# Altium project DiffProbe-Powersupply.PrjPcb (part 2 of 2)

## Sheet PositiveRegulator.SchDoc: Positive Regulator
size A4; SheetNumber: 3; SheetTotal: 3
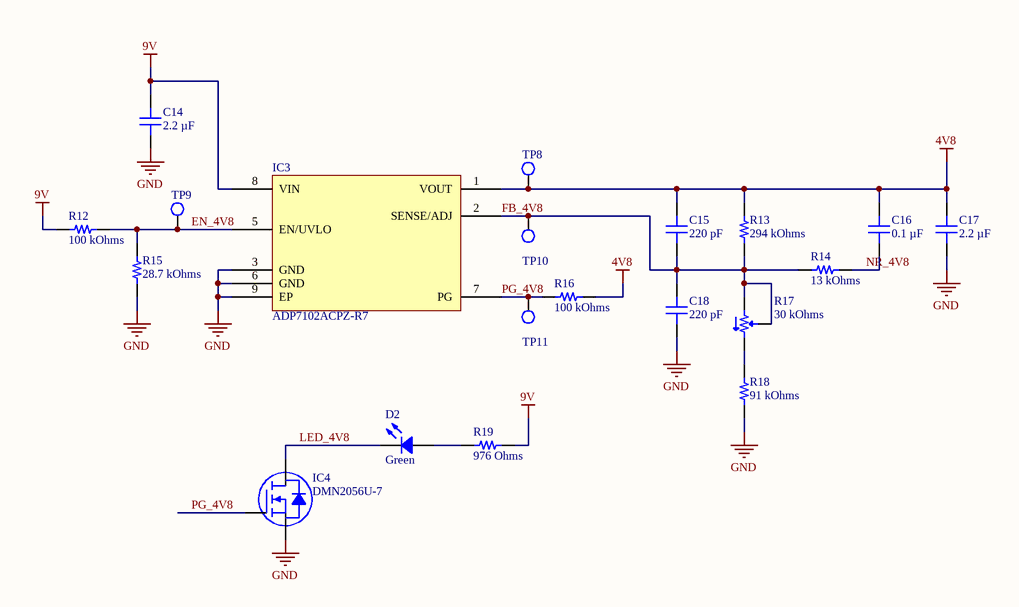
[diagram p2: PositiveRegulator.SchDoc]

### Parts
C14  2.2 µF  [CAP 0805_2012]
C15  220 pF  [CAP 0603_1608]
C16  0.1 µF  [CAP 0603_1608]
C17  2.2 µF  [CAP 0805_2012]
C18  220 pF  [CAP 0603_1608]
D2  Green  [LED 0805_2012 GREEN]
IC3  ADP7102ACPZ-R7  [AD LFCSP-8 3x3MM CP-8-5]
IC4  DMN2056U-7  [DIODES SOT-23-3]
R12  100 kOhms  [RES 0603_1608]
R13  294 kOhms  [RES 0603_1608]
R14  13 kOhms  [RES 0603_1608]
R15  28.7 kOhms  [RES 0603_1608]
R16  100 kOhms  [RES 0603_1608]
R17  30 kOhms  [POT BOURNS TRIMPOT TC33]
R18  91 kOhms  [RES 0603_1608]
R19  976 Ohms  [RES 0805_2012]
TP8  Test Point  [TestPoint-1.5mm]  (value not drawn)  (no BOM)
TP9  Test Point  [TestPoint-1.5mm]  (value not drawn)  (no BOM)
TP10  Test Point  [TestPoint-1.5mm]  (value not drawn)  (no BOM)
TP11  Test Point  [TestPoint-1.5mm]  (value not drawn)  (no BOM)

### Nets
4V8: C15.2 C16.2 C17.2 IC3.1(VOUT) R13.2 R16.2 TP8.1(TP)
9V: C14.2 IC3.8(VIN) R12.2 R19.2
GND: C14.1 C17.1 C18.1 IC3.3(GND) IC3.6(GND) IC3.9(EP) IC4.2(S) R15.1 R18.1
EN_4V8: IC3.5(EN/UVLO) R12.1 R15.2 TP9.1(TP)
FB_4V8: C15.1 C18.2 IC3.2(SENSE/ADJ) R13.1 R14.1 R17.1 R17.2 TP10.1(TP)
LED_4V8: D2.2 IC4.3(D)
NR_4V8: C16.1 R14.2
PG_4V8: IC3.7(PG) IC4.1(G) R16.1 TP11.1(TP)
NetD2_1: D2.1 R19.1
NetR17_3: R17.3 R18.2

### Notes on the sheet
- Title
- Size:
- Date:
- A4
- Number:
- Time:
- Revision:
- Sheet
- of
- File:

### Library data of the parts
C14 C17 = GRM21BR71E225KE11L: CAP CER 2.2UF 25V X7R 0805; manufacturer: Murata Electronics; Tolerance: ±10%; Part Number: GRM21BR71E225KE11L; Value: 2.2 µF; Applications: General Purpose; Capacitance: 2.2 µF; componentlink1description: Datasheet; componentlink1url: https://search.murata.co.jp/Ceramy/image/img/A01X/G101/ENG/GRM21BR71E225KE11-01.pdf; componentlink2description: DigiKey Link; componentlink2url: https://www.digikey.com/en/products/detail/murata-electronics/GRM21BR71E225KE11L/6606096; Device Package: 0805 (2012 Metric); lastupdated: 19/06/2022 07:52:39; Lifecycle Status: Active; Minimum Order: 1; Mounting Type: Surface Mount, MLCC; Operating Temperature: -55°C ~ 125°C; Package / Case: 0805 (2012 Metric); packaging: TapeAndReel; partid: 7355; Part Status: Active; price: 0.03; series: GRM; Size / Dimension: 0.079" L x 0.049" W (2.00mm x 1.25mm); Supplier 1: DigiKey; Supplier Part Number 1: 490-14467-1-ND; Temperature Coefficient: X7R; Thickness (Max): 0.055" (1.40mm); Voltage - Rated: 25V
C15 C18 = CC0603JRNPO8BN221: CAP CER 220PF 25V C0G/NPO 0603; manufacturer: Yageo; Temperature Coefficient: C0G, NP0; Tolerance: ±5%; Part Number: CC0603JRNPO8BN221; Value: 220 pF; Applications: General Purpose; Capacitance: 220 pF; componentlink1description: Datasheet; componentlink1url: https://www.yageo.com/upload/media/product/productsearch/datasheet/mlcc/UPY-GP_NP0_16V-to-50V_17.pdf; componentlink2description: DigiKey Link; componentlink2url: https://www.digikey.com/en/products/detail/yageo/CC0603JRNPO8BN221/5883593; Device Package: 0603 (1608 Metric); lastupdated: 19/06/2022 07:49:09; Lifecycle Status: Active; Minimum Order: 1; Mounting Type: Surface Mount, MLCC; Operating Temperature: -55°C ~ 125°C; Package / Case: 0603 (1608 Metric); packaging: TapeAndReel; partid: 9530; Part Status: Active; price: 0.01; series: CC; Size / Dimension: 0.063" L x 0.031" W (1.60mm x 0.80mm); Supplier 1: DigiKey; Supplier Part Number 1: 311-3953-1-ND; Thickness (Max): 0.035" (0.90mm); Voltage - Rated: 25V
C16 = CL10B104KO8NNNC: CAP CER 0.1UF 16V X7R 0603; manufacturer: Samsung Electro-Mechanics; Tolerance: ±10%; Part Number: CL10B104KO8NNNC; Value: 0.1 µF; Applications: General Purpose; Capacitance: 0.1 µF; componentlink1description: Datasheet; componentlink1url: http://www.samsungsem.com/kr/support/product-search/mlcc/CL10B104KO8NNNC.jsp; componentlink2description: DigiKey Link; componentlink2url: https://www.digikey.com/en/products/detail/samsung-electro-mechanics/CL10B104KO8NNNC/3886663; Device Package: 0603 (1608 Metric); lastupdated: 19/06/2022 07:49:08; Lifecycle Status: Active; Minimum Order: 1; Mounting Type: Surface Mount, MLCC; Operating Temperature: -55°C ~ 125°C; Package / Case: 0603 (1608 Metric); packaging: TapeAndReel; partid: 9791; Part Status: Active; price: 0.01; series: CL; Size / Dimension: 0.063" L x 0.031" W (1.60mm x 0.80mm); Supplier 1: DigiKey; Supplier Part Number 1: 1276-1005-1-ND; Temperature Coefficient: X7R; Thickness (Max): 0.035" (0.90mm); Voltage - Rated: 16V
D2 = APHCM2012CGCK-F01: LED GREEN CLEAR CHIP SMD; Manufacturer: Kingbright; Configuration: Standard; Current - Test: 20mA; Lens Color: Colorless; Lens Size: 1.30mm x 1.25mm; Lens Style: Rectangle with Flat Top; Millicandela Rating: 50mcd; Viewing Angle: 110°; Voltage - Forward (Vf) (Typ): 2.1V; Wavelength - Dominant: 570nm; Wavelength - Peak: 574nm; Part Number: APHCM2012CGCK-F01; Color: Green; ComponentLink1Description: Datasheet; ComponentLink1URL: http://www.kingbrightusa.com/images/catalog/SPEC/APHCM2012CGCK-F01.pdf; ComponentLink2Description: DigiKey Link; ComponentLink2URL: https://www.digikey.com/en/products/detail/kingbright/APHCM2012CGCK-F01/1747492; Device Package: 0805 (2012 Metric); Height (Max): 0.40mm; LastUpdated: 20/06/2022 12:31:45; Lens Transparency: Clear; Lifecycle Status: Active; Minimum Order: 1; Mounting Type: Surface Mount; Package / Case: 0805 (2012 Metric); Packaging: TapeAndReel; PartId: 241; Part Status: Active; Price: 0.06; Series: -; Size / Dimension: 2.00mm L x 1.25mm W; Supplier 1: DigiKey; Supplier Part Number 1: 754-1094-1-ND; Supplier Device Package: Chip LED; Value: Green
IC3 = ADP7102ACPZ-R7: IC REG LIN POS ADJ 300MA 8LFCSP; Manufacturer: Analog Devices Inc.; Control Features: Enable, Power Good, Under Voltage Lockout; Current - Quiescent (Iq): 900 µA; Current - Supply (Max): 1.4 mA; Number of Regulators: 1; Output Configuration: Positive; Output Type: Adjustable; Protection Features: Over Current, Over Temperature, Reverse Polarity; PSRR: 80dB ~ 50dB (10kHz ~ 100kHz); Voltage Dropout (Max): 0.325V @ 300mA; Voltage - Input (Max): 20V; Voltage - Output (Max): 19.675V; Voltage - Output (Min/Fixed): 1.22V; Part Number: ADP7102ACPZ-R7; ComponentLink1Description: Datasheet; ComponentLink1URL: https://www.analog.com/media/en/technical-documentation/data-sheets/ADP7102.pdf; ComponentLink2Description: DigiKey Link; ComponentLink2URL: https://www.digikey.com/en/products/detail/analog-devices-inc/ADP7102ACPZ-R7/3043434; Current - Output: 300mA; LastUpdated: 20/06/2022 12:50:21; Lifecycle Status: Active; Minimum Order: 1; Mounting Type: Surface Mount; Operating Temperature: -40°C ~ 125°C; Package / Case: 8-WFDFN Exposed Pad, CSP; Packaging: TapeAndReel; Part Status: Active; Price: 2.42; Series: -; Supplier 1: DigiKey; Supplier Part Number 1: 505-ADP7102ACPZ-R7CT-ND; Supplier Device Package: 8-LFCSP-WD (3x3)
IC4 = DMN2056U-7: MOSFET N-CHANNEL 20V 4A SOT23-3; Manufacturer: Diodes Incorporated; Current - Continuous Drain (Id) @ 25°C: 4A (Ta); Drive Voltage (Max Rds On,  Min Rds On): 1.5V, 4.5V; Gate Charge (Qg) (Max) @ Vgs: 4.3 nC @ 4.5 V; Input Capacitance (Ciss) (Max) @ Vds: 339 pF @ 10 V; Power Dissipation (Max): 940mW; Rds On (Max) @ Id, Vgs: 38mOhm @ 3.6A, 4.5V; Vgs (Max): ±8V; Vgs(th) (Max) @ Id: 1V @ 250µA; Part Number: DMN2056U-7; ComponentLink1Description: Datasheet; ComponentLink1URL: https://www.diodes.com/assets/Datasheets/DMN2056U.pdf; ComponentLink2Description: DigiKey Link; ComponentLink2URL: https://www.digikey.com/en/products/detail/diodes-incorporated/DMN2056U-7/7352909; Drain to Source Voltage (Vdss): 20 V; FET Type: N-Channel; LastUpdated: 20/06/2022 12:38:07; Lifecycle Status: Active; Minimum Order: 1; Mounting Type: Surface Mount; Operating Temperature: -55°C ~ 150°C (TJ); Package / Case: TO-236-3, SC-59, SOT-23-3; Packaging: TapeAndReel; Part Status: Active; Price: 0.09; Series: -; Supplier 1: DigiKey; Supplier Part Number 1: DMN2056U-7DICT-ND; Supplier Device Package: SOT-23-3; Technology: MOSFET (Metal Oxide)
R12 R16 = RS73F1JTTD1003B: RES 100K OHM 0.1% 1/5W 0603; Manufacturer: KOA Speer Electronics, Inc.; Power (Watts): 0.2W, 1/5W; Temperature Coefficient: ±25ppm/°C; Part Number: RS73F1JTTD1003B; Value: 100 kOhms; ComponentLink1Description: Datasheet; ComponentLink1URL: http://www.koaspeer.com/pdfs/RS73.pdf; ComponentLink2Description: DigiKey Link; ComponentLink2URL: https://www.digikey.com/en/products/detail/koa-speer-electronics-inc/RS73F1JTTD1003B/11594402; Composition: Thick Film; Device Package: 0603 (1608 Metric); Features: Automotive AEC-Q200, Moisture Resistant; Height - Seated (Max): 0.022" (0.55mm); LastUpdated: 19/06/2022 08:07:20; Lifecycle Status: Active; Minimum Order: 1; Number of Terminations: 2; Operating Temperature: -55°C ~ 155°C; Package / Case: 0603 (1608 Metric); Packaging: TapeAndReel; PartId: 56386; Part Status: Active; Price: 0.08; Ratings: AEC-Q200; Resistance: 100 kOhms; Series: RS73; Size / Dimension: 0.063" L x 0.031" W (1.60mm x 0.80mm); Supplier 1: DigiKey; Supplier Part Number 1: 2019-RS73F1JTTD1003BCT-ND; Supplier Device Package: 0603; Tolerance: ±0.1%
R13 = ERA-3AEB2943V: RES SMD 294K OHM 0.1% 1/10W 0603; Manufacturer: Panasonic Electronic Components; Power (Watts): 0.1W, 1/10W; Temperature Coefficient: ±25ppm/°C; Part Number: ERA-3AEB2943V; Value: 294 kOhms; ComponentLink1Description: Datasheet; ComponentLink1URL: https://industrial.panasonic.com/cdbs/www-data/pdf/RDM0000/AOA0000C307.pdf; ComponentLink2Description: DigiKey Link; ComponentLink2URL: https://www.digikey.com/en/products/detail/panasonic-electronic-components/ERA-3AEB2943V/2026969; Composition: Thin Film; Device Package: 0603 (1608 Metric); Features: Automotive AEC-Q200; Height - Seated (Max): 0.022" (0.55mm); LastUpdated: 19/06/2022 08:07:50; Lifecycle Status: Active; Minimum Order: 1; Number of Terminations: 2; Operating Temperature: -55°C ~ 155°C; Package / Case: 0603 (1608 Metric); Packaging: TapeAndReel; PartId: 22652; Part Status: Active; Price: 0.04; Ratings: AEC-Q200; Resistance: 294 kOhms; Series: ERA-3A; Size / Dimension: 0.063" L x 0.031" W (1.60mm x 0.80mm); Supplier 1: DigiKey; Supplier Part Number 1: P294KDBCT-ND; Supplier Device Package: 0603; Tolerance: ±0.1%
R14 = RMCF0603FT13K0: RES 13K OHM 1% 1/10W 0603; Manufacturer: Stackpole Electronics Inc; Power (Watts): 0.1W, 1/10W; Temperature Coefficient: ±100ppm/°C; Part Number: RMCF0603FT13K0; Value: 13 kOhms; ComponentLink1Description: Datasheet; ComponentLink1URL: https://www.seielect.com/catalog/sei-rmcf_rmcp.pdf; ComponentLink2Description: DigiKey Link; ComponentLink2URL: https://www.digikey.com/en/products/detail/stackpole-electronics-inc/RMCF0603FT13K0/1761291; Composition: Thick Film; Device Package: 0603 (1608 Metric); Features: Automotive AEC-Q200; Height - Seated (Max): 0.022" (0.55mm); LastUpdated: 20/06/2022 12:10:26; Lifecycle Status: Active; Minimum Order: 1; Number of Terminations: 2; Operating Temperature: -55°C ~ 155°C; Package / Case: 0603 (1608 Metric); Packaging: CutTape; PartId: 10642; Part Status: Active; Price: 0.01; Ratings: AEC-Q200; Resistance: 13 kOhms; Series: RMCF; Size / Dimension: 0.061" L x 0.031" W (1.55mm x 0.80mm); Supplier 1: DigiKey; Supplier Part Number 1: RMCF0603FT13K0CT-ND; Supplier Device Package: 0603; Tolerance: ±1%
R15 = RC0603FR-0728K7L: RES 28.7K OHM 1% 1/10W 0603; Manufacturer: Yageo; Power (Watts): 0.1W, 1/10W; Temperature Coefficient: ±100ppm/°C; Part Number: RC0603FR-0728K7L; Value: 28.7 kOhms; ComponentLink1Description: Datasheet; ComponentLink1URL: https://www.yageo.com/upload/media/product/productsearch/datasheet/rchip/PYu-RC_Group_51_RoHS_L_10.pdf; ComponentLink2Description: DigiKey Link; ComponentLink2URL: https://www.digikey.com/en/products/detail/yageo/RC0603FR-0728K7L/727110; Composition: Thick Film; Device Package: 0603 (1608 Metric); Features: Moisture Resistant; Height - Seated (Max): 0.022" (0.55mm); LastUpdated: 20/06/2022 12:10:21; Lifecycle Status: Active; Minimum Order: 1; Number of Terminations: 2; Operating Temperature: -55°C ~ 155°C; Package / Case: 0603 (1608 Metric); Packaging: CutTape; PartId: 12499; Part Status: Active; Price: 0.01; Resistance: 28.7 kOhms; Series: RC_L; Size / Dimension: 0.063" L x 0.031" W (1.60mm x 0.80mm); Supplier 1: DigiKey; Supplier Part Number 1: 311-28.7KHRCT-ND; Supplier Device Package: 0603; Tolerance: ±1%
R17 = TC33X-2-303E: TRIMMER 30K OHM 0.1W J LEAD TOP; Manufacturer: Bourns Inc.; Adjustment Type: Top Adjustment; Number of Turns: 1; Power (Watts): 0.1W, 1/10W; Resistive Material: Cermet; Temperature Coefficient: ±250ppm/°C; Tolerance: ±25%; Part Number: TC33X-2-303E; ComponentLink1Description: Datasheet; ComponentLink1URL: https://www.bourns.com/docs/Product-Datasheets/TC33.pdf; ComponentLink2Description: DigiKey Link; ComponentLink2URL: https://www.digikey.com/en/products/detail/bourns-inc/TC33X-2-303E/2566895; LastUpdated: 20/06/2022 12:32:03; Lifecycle Status: Active; Minimum Order: 1; Mounting Type: Surface Mount; Packaging: TapeAndReel; PartId: 15; Part Status: Active; Price: 0.11; Resistance: 30 kOhms; Series: Trimpot® TC33 - Open Frame; Size / Dimension: Rectangular - 0.150" x 0.142" Face x 0.047" H (3.80mm x 3.60mm x 1.20mm); Supplier 1: DigiKey; Supplier Part Number 1: TC33X-2-303ECT-ND; Termination Style: J Lead; Value: 30 kOhms
R18 = RC0603FR-0791KL: RES 91K OHM 1% 1/10W 0603; Manufacturer: Yageo; Power (Watts): 0.1W, 1/10W; Temperature Coefficient: ±100ppm/°C; Part Number: RC0603FR-0791KL; Value: 91 kOhms; ComponentLink1Description: Datasheet; ComponentLink1URL: https://www.yageo.com/upload/media/product/productsearch/datasheet/rchip/PYu-RC_Group_51_RoHS_L_10.pdf; ComponentLink2Description: DigiKey Link; ComponentLink2URL: https://www.digikey.com/en/products/detail/yageo/RC0603FR-0791KL/727428; Composition: Thick Film; Device Package: 0603 (1608 Metric); Features: Moisture Resistant; Height - Seated (Max): 0.022" (0.55mm); LastUpdated: 20/06/2022 12:10:33; Lifecycle Status: Active; Minimum Order: 1; Number of Terminations: 2; Operating Temperature: -55°C ~ 155°C; Package / Case: 0603 (1608 Metric); Packaging: CutTape; PartId: 7596; Part Status: Active; Price: 0.01; Resistance: 91 kOhms; Series: RC_L; Size / Dimension: 0.063" L x 0.031" W (1.60mm x 0.80mm); Supplier 1: DigiKey; Supplier Part Number 1: 311-91.0KHRCT-ND; Supplier Device Package: 0603; Tolerance: ±1%
R19 = RC0805FR-07976RL: RES 976 OHM 1% 1/8W 0805; Manufacturer: Yageo; Power (Watts): 0.125W, 1/8W; Temperature Coefficient: ±100ppm/°C; Part Number: RC0805FR-07976RL; Value: 976 Ohms; ComponentLink1Description: Datasheet; ComponentLink1URL: https://www.yageo.com/upload/media/product/productsearch/datasheet/rchip/PYu-RC_Group_51_RoHS_L_10.pdf; ComponentLink2Description: DigiKey Link; ComponentLink2URL: https://www.digikey.com/en/products/detail/yageo/RC0805FR-07976RL/728214; Composition: Thick Film; Device Package: 0805 (2012 Metric); Features: Moisture Resistant; Height - Seated (Max): 0.024" (0.60mm); LastUpdated: 20/06/2022 12:21:47; Lifecycle Status: Active; Minimum Order: 1; Number of Terminations: 2; Operating Temperature: -55°C ~ 155°C; Package / Case: 0805 (2012 Metric); Packaging: TapeAndReel; PartId: 36922; Part Status: Active; Price: 0.01; Resistance: 976 Ohms; Series: RC_L; Size / Dimension: 0.079" L x 0.049" W (2.00mm x 1.25mm); Supplier 1: DigiKey; Supplier Part Number 1: 311-976CRCT-ND; Supplier Device Package: 0805; Tolerance: ±1%
TP8-TP11 = CMP-003-000000-1: Component Type: Standard (No BOM); Source: Test Point.SchLib; Design Item ID: Test Point; Pin Count: 1

## Nets that join several sheets
4V8: Powersupply (J1.8), PositiveRegulator (7 pins)
9V: Powersupply (8 pins), NegativeRegulator (5 pins), PositiveRegulator (C14.2 IC3.8 R12.2 R19.2)
-4V8: Powersupply (J1.4), NegativeRegulator (8 pins)
GND: Powersupply (20 pins), NegativeRegulator (17 pins), PositiveRegulator (9 pins)

## Assembly variants
Full Board: not fitted R17